# Altium schematic sheet KODO频谱时钟 2022-07-24.schdoc
size 221 x 179 mm
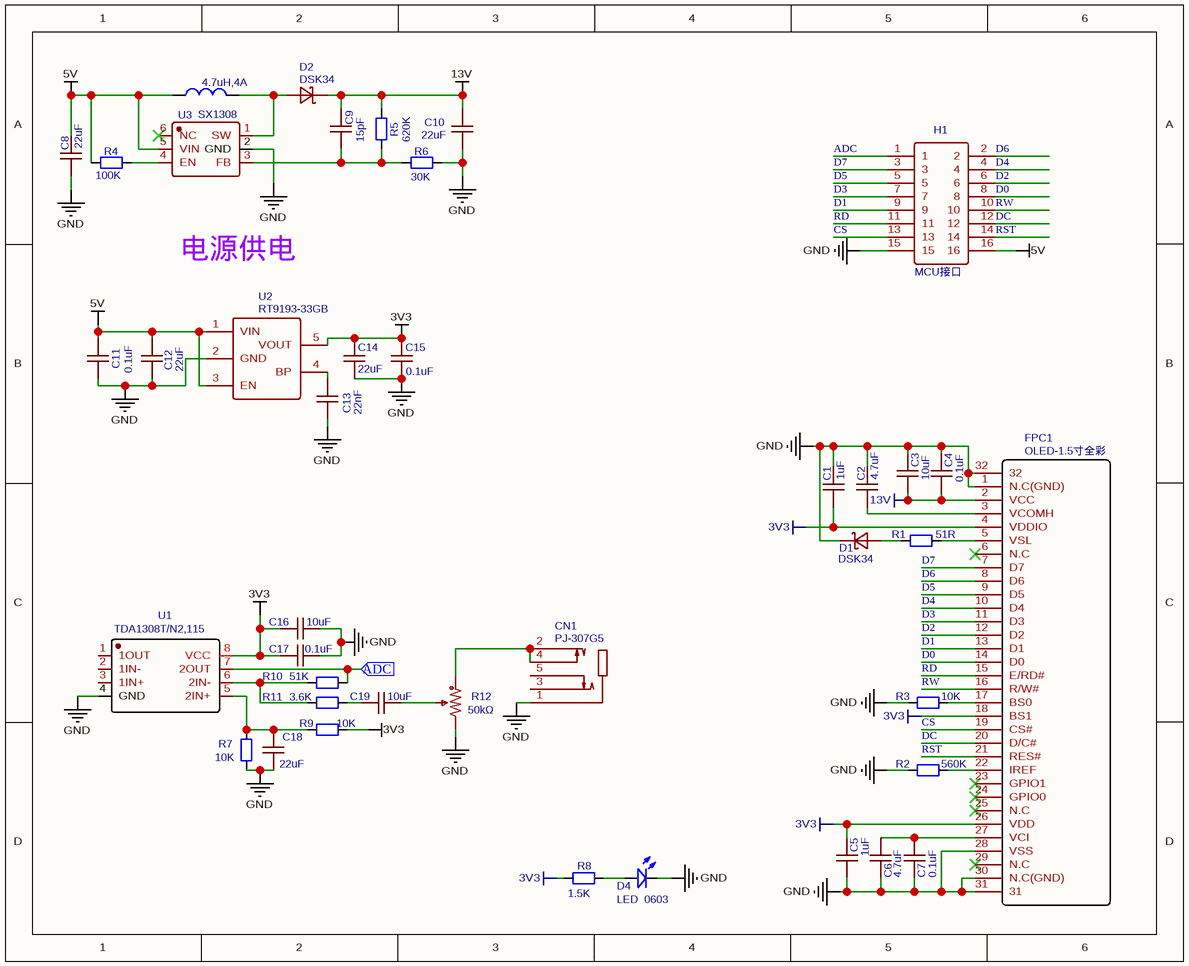
[diagram p0: KODO频谱时钟 2022-07-24.schdoc]

## Parts
6  4.7uH,4A  [D-L1812-1]
C1  1uF  [C  0603]
C2  4.7uF  [C  0603]
C3  10uF  [C  0603]
C4  0.1uF  [C  0603]
C5  1uF  [C  0603]
C6  4.7uF  [C  0603]
C7  0.1uF  [C  0603]
C8  22uF  [C  0603]
C9  15pF  [C  0603]
C10  22uF  [C  0603]
C11  0.1uF  [C  0603]
C12  22uF  [C  0603]
C13  22nF  [C  0603]
C14  22uF  [C  0603]
C15  0.1uF  [C  0603]
C16  10uF  [C  0603]
C17  0.1uF  [C  0603]
C18  22uF  [C  0603]
C19  10uF  [C  0603]
CN1  PJ-307G5  [AUDIO-TH_PJ-307G5]
D1  DSK34  [SOD-123]
D2  DSK34  [SOD-123]
D4  LED  0603  [LED 0603]
FPC1  OLED-1.5寸全彩  [FPC-SMD 30P-P0.50]
H1  MCU接口  [排针排母2*8P]
R1  51R  [R 0603]
R2  560K  [R 0603]
R3  10K  [R 0603]
R4  100K  [R 0603]
R5  620K  [R 0603]
R6  30K  [R 0603]
R7  10K  [R 0603]
R8  1.5K  [R 0603]
R9  10K  [R 0603]
R10  51K  [R 0603]
R11  3.6K  [R 0603]
R12  50kΩ  [RES-ADJ-TH_3P-L9.5-W4.85-P2.50-BL-BS]
U1  TDA1308T/N2,115  [SOIC-8_L5.0-W4.0-P1.27-LS6.0-BL]
U2  RT9193-33GB  [SOT-23-5_L3.0-W1.7-P0.95-LS2.8-BR]
U3  SX1308  [SOT23-6]

## Ports
ADC (in)

## Nets
3V3: C1.2 C5.1 C14.1 C15.1 C16.1 C17.1 FPC1.4(VDDIO) FPC1.18(BS1) FPC1.26(VDD) R8.2 R9.1 U1.8(VCC) U2.5(VOUT)
5V: 6.1 C8.1 C11.1 C12.1 H1.16 R4.1 U2.1(VIN) U2.3(EN) U3.5(VIN)
13V: C3.2 C4.2 C9.1 C10.1 D2.2(K) FPC1.2(VCC) R5.2
GND: C1.1 C2.1 C3.1 C4.1 C5.2 C6.2 C7.2 C8.2 C10.2 C11.2 C12.2 C13.2 C14.2 C15.2 C16.2 C17.2 C18.1 CN1.1 D1.2(K) D4.2 FPC1.1(N.C(GND)) FPC1.28(VSS) FPC1.30(N.C(GND)) FPC1.31 FPC1.32 H1.15 R2.1 R3.1 R6.2 R7.2 R12.3 U1.4(GND) U2.2(GND) U3.2(GND)
ADC: R10.1 U1.7(2OUT) ; port ADC
ADC: H1.1  [a separate net that carries the same name]
CS: FPC1.19(CS#) H1.13
D0: FPC1.14(D0) H1.8
D1: FPC1.13(D1) H1.9
D2: FPC1.12(D2) H1.6
D3: FPC1.11(D3) H1.7
D4: FPC1.10(D4) H1.4
D5: FPC1.9(D5) H1.5
D6: FPC1.8(D6) H1.2
D7: FPC1.7(D7) H1.3
DC: FPC1.20(D/C#) H1.12
RD: FPC1.15(E/RD#) H1.11
RST: FPC1.21(RES#) H1.14
RW: FPC1.16(R/W#) H1.10
Net6_2: 6.2 D2.1(A) U3.1(SW)
NetC2_2: C2.2 FPC1.3(VCOMH)
NetC6_1: C6.1 C7.1 FPC1.27(VCI)
NetC9_2: C9.2 R5.1 R6.1 U3.3(FB)
NetC13_1: C13.1 U2.4(BP)
NetC18_2: C18.2 R7.1 R9.2 U1.5(2IN+)
NetC19_1: C19.1 R11.1
NetC19_2: C19.2 R12.2
NetCN1_2: CN1.2 CN1.4 R12.1
NetD1_1: D1.1(A) R1.1
NetD4_1: D4.1 R8.1
NetFPC1_5: FPC1.5(VSL) R1.2
NetFPC1_17: FPC1.17(BS0) R3.2
NetFPC1_22: FPC1.22(IREF) R2.2
NetR4_2: R4.2 U3.4(EN)
NetR10_2: R10.2 R11.2 U1.6(2IN-)

Not connected (* = marked no-connect by the designer): CN1 3 5; FPC1 6(N.C)* 23(GPIO1)* 24(GPIO0)* 25(N.C)* 29(N.C)*; U1 1(1OUT) 2(1IN-) 3(1IN+); U3 6(NC)*

## Notes on the sheet
- 电源供电

## Library data of the parts
6 = 4.7uH,4A: Contributor: 酷电玩家; spicePre: L; spiceSymbolName: D-I 1812
C1 C5 = 1uF: Contributor: PQG2030PQG; spicePre: C; spiceSymbolName: C 0603
C2 C6 = 4.7uF: Contributor: PQG2030PQG; spicePre: C; spiceSymbolName: C 0603
C3 C16 C19 = 10uF: Contributor: PQG2030PQG; spicePre: C; spiceSymbolName: C 0603
C4 C7 C11 C15 C17 = 0.1uF: Contributor: PQG2030PQG; spicePre: C; spiceSymbolName: C 0603
C8 C10 C12 C14 C18 = 22uF: Contributor: PQG2030PQG; spicePre: C; spiceSymbolName: C 0603
C9 = 15pF: Contributor: PQG2030PQG; spicePre: C; spiceSymbolName: C 0603
C13 = 22nF: Contributor: PQG2030PQG; spicePre: C; spiceSymbolName: C 0603
CN1 = PJ-307G5: BOM_Manufacturer: XKB Enterprise; Contributor: LCSC; BOM_Supplier: LCSC; BOM_Supplier Part: C381128; BOM_Manufacturer Part: PJ-307G5; BOM_JLCPCB Part Class: Extended Part; spicePre: C; spiceSymbolName: PJ-307G5
D1 D2 = DSK34: BOM_Manufacturer: MDD; Contributor: PQG2030PQG; BOM_Supplier: LCSC; BOM_Manufacturer Part: DSK34; BOM_Supplier Part: C41029; spicePre: D; spiceSymbolName: DSK34
D4 = LED  0603: Contributor: PQG2030PQG; spicePre: D; spiceSymbolName: LED  0603
FPC1 = OLED-1.5寸全彩: BOM_Manufacturer: MINTRON; BOM_Manufacturer Part: XW05200-30; Contributor: 酷电玩家; BOM_Supplier: LCSC; BOM_Supplier Part: C376069; BOM_JLCPCB Part Class: Extended Part; spicePre: F; spiceSymbolName: OLED-1.5寸全彩
H1 = MCU接口: BOM_Manufacturer: Shenzhen Cankemeng; Contributor: PQG2030PQG; BOM_Supplier: LCSC; BOM_Supplier Part: C169817; BOM_Manufacturer Part: -; spicePre: H; spiceSymbolName: 排针排母2*8P
R1 = 51R: Contributor: PQG2030PQG; spicePre: R; spiceSymbolName: R 0603
R2 = 560K: Contributor: PQG2030PQG; spicePre: R; spiceSymbolName: R 0603
R3 R7 R9 = 10K: Contributor: PQG2030PQG; spicePre: R; spiceSymbolName: R 0603
R4 = 100K: Contributor: PQG2030PQG; spicePre: R; spiceSymbolName: R 0603
R5 = 620K: Contributor: PQG2030PQG; spicePre: R; spiceSymbolName: R 0603
R6 = 30K: Contributor: PQG2030PQG; spicePre: R; spiceSymbolName: R 0603
R8 = 1.5K: Contributor: PQG2030PQG; spicePre: R; spiceSymbolName: R 0603
R10 = 51K: Contributor: PQG2030PQG; spicePre: R; spiceSymbolName: R 0603
R11 = 3.6K: Contributor: PQG2030PQG; spicePre: R; spiceSymbolName: R 0603
R12 = 50kΩ: BOM_Manufacturer: Chengdu Guosheng Tech; BOM_Manufacturer Part: 3296W-1-503; Resistance(Ohms): 50K; nameAlias: Resistance; Contributor: LCSC; BOM_Supplier: LCSC; BOM_Supplier Part: C118911; Resistance (Ohms): 50K; BOM_JLCPCB Part Class: Extended Part; spicePre: R; spiceSymbolName: 3296W-1-503
U1 = TDA1308T/N2,115: BOM_Manufacturer: NXP; BOM_Supplier: LCSC; BOM_Manufacturer Part: TDA1308T/N2,115; BOM_Supplier Part: C38340; BOM_JLCPCB Part Class: Extended Part; spicePre: U; spiceSymbolName: TDA1308T/N2,115
U2 = RT9193-33GB: BOM_Manufacturer: RICHTEK; BOM_Supplier: LCSC; BOM_Manufacturer Part: RT9193-33GB; BOM_Supplier Part: C15651; BOM_JLCPCB Part Class: Extended Part; spicePre: U; spiceSymbolName: RT9193-33GB
U3 = SX1308: BOM_Manufacturer: SX; sourceId: g4Yg9rJ1j; Contributor: 酷电玩家; timeStamp: 1472247539; BOM_Supplier: LCSC; BOM_Manufacturer Part: SX1308; BOM_Supplier Part: C78162; BOM_JLCPCB Part Class: Extended Part; spicePre: U; spiceSymbolName: SX1308